# Altium schematic sheet ST25R.SchDoc
size A3; SheetNumber: 10; SheetTotal: 10
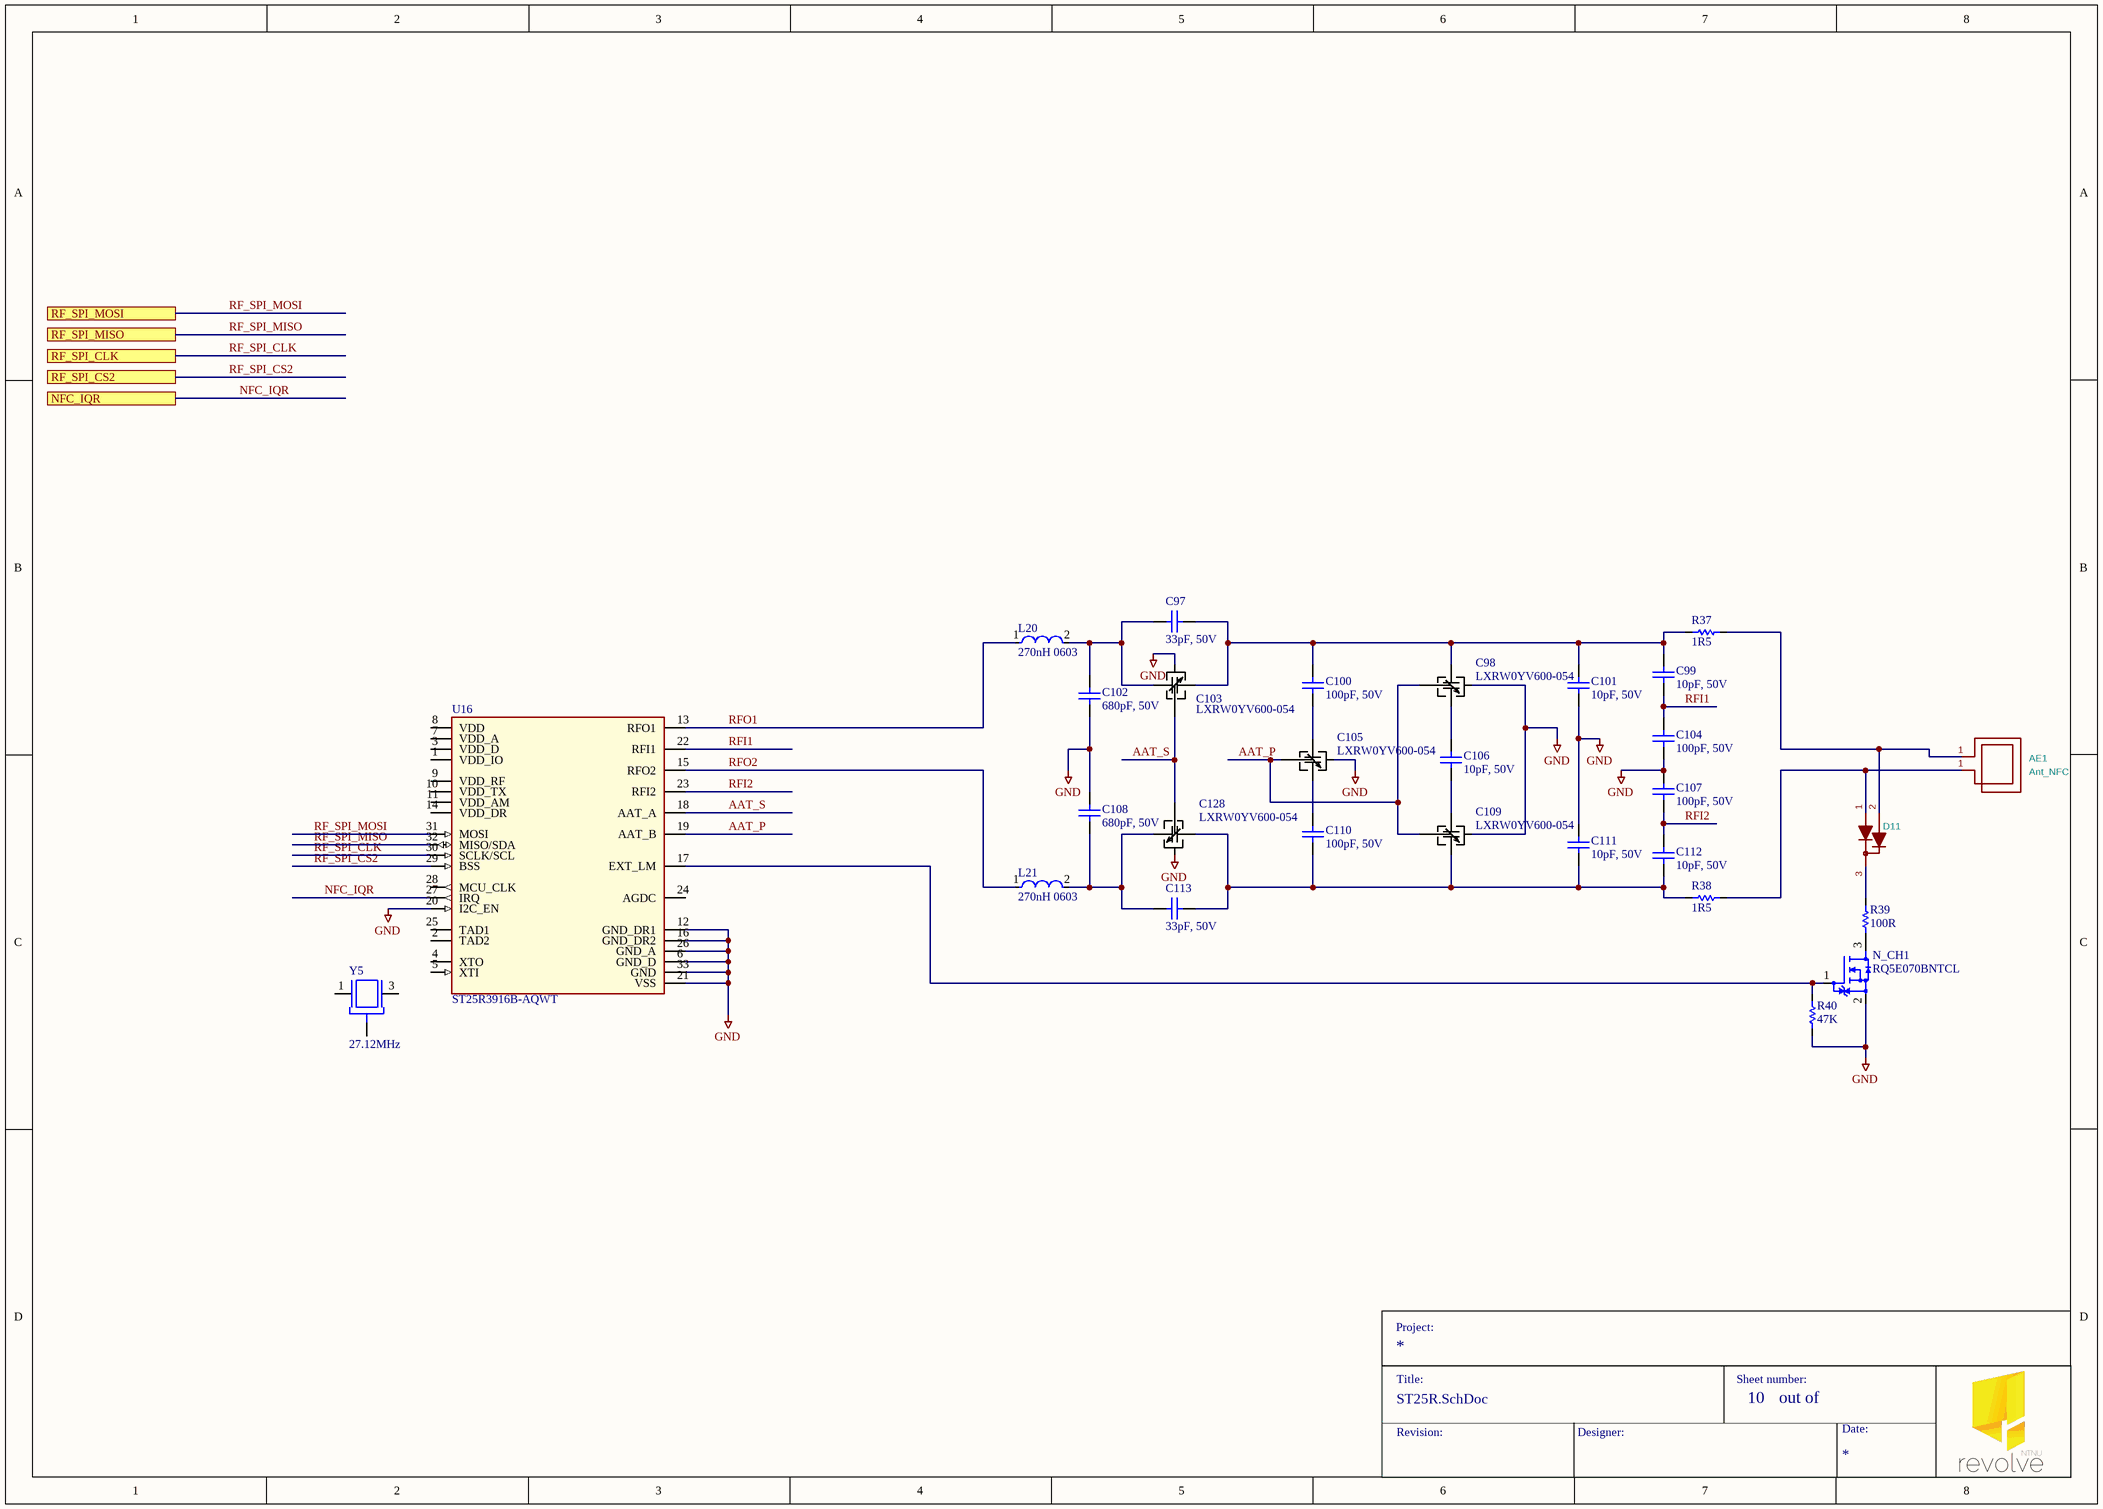
[diagram p0: ST25R.SchDoc]

## Parts
AE1  Ant_NFC  [Jarvis_NFC_Ant]
C97  33pF, 50V  [0402 resistor]
C98  LXRW0YV600-054  [LXRW0_MUR-M]
C99  10pF, 50V  [0402 resistor]
C100  100pF, 50V  [0402 resistor]
C101  10pF, 50V  [0402 resistor]
C102  680pF, 50V  [0402 resistor]
C103  LXRW0YV600-054  [LXRW0_MUR-M]
C104  100pF, 50V  [0402 resistor]
C105  LXRW0YV600-054  [LXRW0_MUR-M]
C106  10pF, 50V  [0402 resistor]
C107  100pF, 50V  [0402 resistor]
C108  680pF, 50V  [0402 resistor]
C109  LXRW0YV600-054  [LXRW0_MUR-M]
C110  100pF, 50V  [0402 resistor]
C111  10pF, 50V  [0402 resistor]
C112  10pF, 50V  [0402 resistor]
C113  33pF, 50V  [0402 resistor]
C128  LXRW0YV600-054  [LXRW0_MUR-M]
D11  BAV70W-7-F  [SOT65P210X100-3N]  (value not drawn)
L20  270nH 0603  [INDC1608X95N]
L21  270nH 0603  [INDC1608X95N]
N_CH1  RQ5E070BNTCL  [RTR040N03HZGTL-Footprint-1]
R37  1R5  [RESC1005X40X25ML05T05]
R38  1R5  [RESC1005X40X25ML05T05]
R39  100R  [RESC1005X40X25ML05T05]
R40  47K  [0603 Resistor]
U16  ST25R3916B-AQWT  [VFQFPN32_5X5_WETTABLE_STM-M]
Y5  27.12MHz  [XTAL_ECS-400-10-37B2-CKM-TR]

## Ports
NFC_IQR, RF_SPI_CLK, RF_SPI_CS2, RF_SPI_MISO, RF_SPI_MOSI

## Nets
GND: C98.1(GND) C101.1 C102.1 C103.1(GND) C104.1 C105.1(GND) C107.2 C108.2 C109.1(GND) C111.2 C128.1(GND) N_CH1.2(S) R40.1 U16.6(GND_D) U16.12(GND_DR1) U16.16(GND_DR2) U16.20(I2C_EN) U16.21(VSS) U16.26(GND_A) U16.33(GND)
AAT_P: C98.2(VT) C105.2(VT) C109.2(VT) U16.19(AAT_B)
AAT_S: C103.2(VT) C128.2(VT) U16.18(AAT_A)
NFC_IQR: U16.27(IRQ) ; port NFC_IQR
RF_SPI_CLK: U16.30(SCLK/SCL) ; port RF_SPI_CLK
RF_SPI_CS2: U16.29(BSS) ; port RF_SPI_CS2
RF_SPI_MISO: U16.32(MISO/SDA) ; port RF_SPI_MISO
RF_SPI_MOSI: U16.31(MOSI) ; port RF_SPI_MOSI
RFI1: C99.1 C104.2 U16.22(RFI1)
RFI2: C107.1 C112.2 U16.23(RFI2)
RFO1: L20.1 U16.13(RFO1)
RFO2: L21.1 U16.15(RFO2)
NetAE1_1: AE1.1 D11.1 R38.2
NetAE1_1: AE1.1 D11.2 R37.2  [a separate net that carries the same name]
NetC97_1: C97.1 C102.2 C103.3(PORT1) L20.2
NetC97_2: C97.2 C98.3(PORT1) C99.2 C100.2 C101.2 C103.4(PORT2) R37.1
NetC98_4: C98.4(PORT2) C106.2
NetC100_1: C100.1 C105.3(PORT1)
NetC105_4: C105.4(PORT2) C110.2
NetC106_1: C106.1 C109.3(PORT1)
NetC108_1: C108.1 C113.1 C128.4(PORT2) L21.2
NetC109_4: C109.4(PORT2) C110.1 C111.1 C112.1 C113.2 C128.3(PORT1) R38.1
NetD11_3: D11.3 R39.2
NetN_CH1_1: N_CH1.1(G) R40.2 U16.17(EXT_LM)
NetN_CH1_3: N_CH1.3(D) R39.1
NetY5_2: Y5.2(GND) Y5.4(GND)

Not connected (* = marked no-connect by the designer): U16 1(VDD_IO) 2(TAD2) 3(VDD_D) 4(XTO) 5(XTI) 7(VDD_A) 8(VDD) 9(VDD_RF) 10(VDD_TX) 11(VDD_AM) 14(VDD_DR) 24(AGDC) 25(TAD1) 28(MCU_CLK); Y5 1(IN/OUT) 3(OUT/IN)

## Notes on the sheet
- Project:
- Title:
- Sheet number:
- Revision:
- Designer:
- out of
- Date:

## Library data of the parts
C97 C113 = CMP-00399-1: 50V 33pF C0G ±1% 0402 Multilayer Ceramic Capacitors MLCC - SMD/SMT ROHS; Max Operating Temperature: 125°C; Case/Package: 0402; Voltage Rating (DC): 50V; Voltage Rating: 50V; Min Operating Temperature: -55°C; Value: 33pF; Tolerance: 1%
C98 C103 C105 C109 C128 = LXRW0YV600: Variable capacitor 30-60pF; Supplier 1: DigiKey; Supplier Part Number 1: 490-18379-1-ND
C99 C101 C106 C111 C112 = CMP-00396-1: 10pF, 50V, 10%, 0402; Value: 10pF; Voltage Rating (DC): 50V
C100 C104 C107 C110 = CMP-001-O95-2: 100pF, 50V, Tolerance, Temperature, 0402
C102 C108 = CMP-00398-1: Ceramic Capacitor, Multilayer, Ceramic, 50V, 1% +Tol, 1% -Tol, C0G, 30ppm/Cel TC, 0.00068uF, Surface Mount, 0402; Value: 680pF; Voltage Rating (DC): 50V; Min Operating Temperature: -55°C; Tolerance: 1%; Voltage Rating: 50V; Max Operating Temperature: 125°C
D11 = BAV70W-7-F: Manufacturer_Name: Diodes Incorporated; Height: 1; Manufacturer_Part_Number: BAV70W-7-F; Value: BAV70W-7-F
L20 L21 = Inductor SMD 270nH: Multilayer Type Inductor for Power Lines, 0603, 270nH, 30%, 0.286Ω, 500mA, MLJ1608WR27JT000; DC Resistance (DCR): 175mR; Max DC Current: 1.1A; Self Resonant Frequency: 20MHz; Inductance: 4.7uH; Test Frequency: 1MHz; Core Material: Ferrite; Shielding: Shielded; Case Code (Metric): 2016; Min Operating Temperature: -40°C; Width: 1.6mm; Depth: 1.6mm; Inductance Tolerance: 30%; Max Operating Temperature: 125°C; Length: 2mm; Case Code (Imperial): 0806; Case/Package: 0806; Tolerance: 30%; Military Standard: Not; Current Rating: 1.1A; Packaging: Tape and Reel; Package Quantity: 1; Lead Free: Lead Free; Termination: SMD/SMT; Height - Seated (Max): 0.039inch; REACH SVHC: No SVHC; Mount: Surface Mount; DC Current: 1.1A; Height: 0.9mm; Supplier 1: Newark; Supplier Part Number 1: MLJ1608WR27JT000
N_CH1 = CMP-001-Q89.0.1: Small Signal Field-Effect Transistor, 7A I(D), 30V, 1-Element, N-Channel, Silicon, Metal-oxide Semiconductor FET; Reach SVHC Compliant: Yes; RoHS Compliant: Yes; Moisture Sensitivity Level: 1
R37 R38 = CMP-001-R15-2: 1R5 1% 1/8W, 0402; Temperature Coefficient: 200ppm/°C; Voltage Rating (DC): 50V; Max Power Dissipation: 63mW; Mounting Technology: Surface Mount; Tolerance: 1%; Case/Package: 0402; Voltage Rating: 50V
R39 = CMP-00400-1: 100R 1% 1/8W, 0402; Max Power Dissipation: 63mW; Temperature Coefficient: 100ppm/°C; Voltage Rating: 50V; Mounting Technology: Surface Mount; Tolerance: 1%; Case/Package: 0402; Voltage Rating (DC): 50V
R40 = CMP-001-B87-6: 47K, 1%, 1/10W, 0603
U16 = ST25R3916B-AQWT: NFC reader for payment, consumer and industrial; Manufacturer_Name: STMicroelectronics; Type: RFID, RF Access, Monitoring ICs; Copyright: Copyright (C) 2025 Ultra Librarian. All rights reserved.; Manufacturer_Part_Number: ST25R3916B-AQWT; RefDes: RefDes
Y5 = ECS-271.2-10-37-CKM-TR: Crystal 27.12MHz ±10ppm (Tol) ±10ppm (Stability) 10pF FUND 60Ohm 4-Pin Mini-CSMD T/R; MF: ECS Inc.; MP: ECS-400-10-37B2-CKM-TR; SnapEDA_Link: https://www.snapeda.com/parts/ECS-400-10-37B2-CKM-TR/ECS+Inc./view-part/?ref=snap; Package: ECX-1637B-37B-4 ECS; Value: *; Check_prices: https://www.snapeda.com/parts/ECS-400-10-37B2-CKM-TR/ECS+Inc./view-part/?ref=eda; Supplier 1: DigiKey; Supplier Part Number 1: XC2511CT-ND
AE1 = Ant_NFC: Value: Ant_NFC; Footprint: Lol_20230821:Jarvis_NFC_Ant